# EAGLE design stm_ucboard (EAGLE 6.5.0)
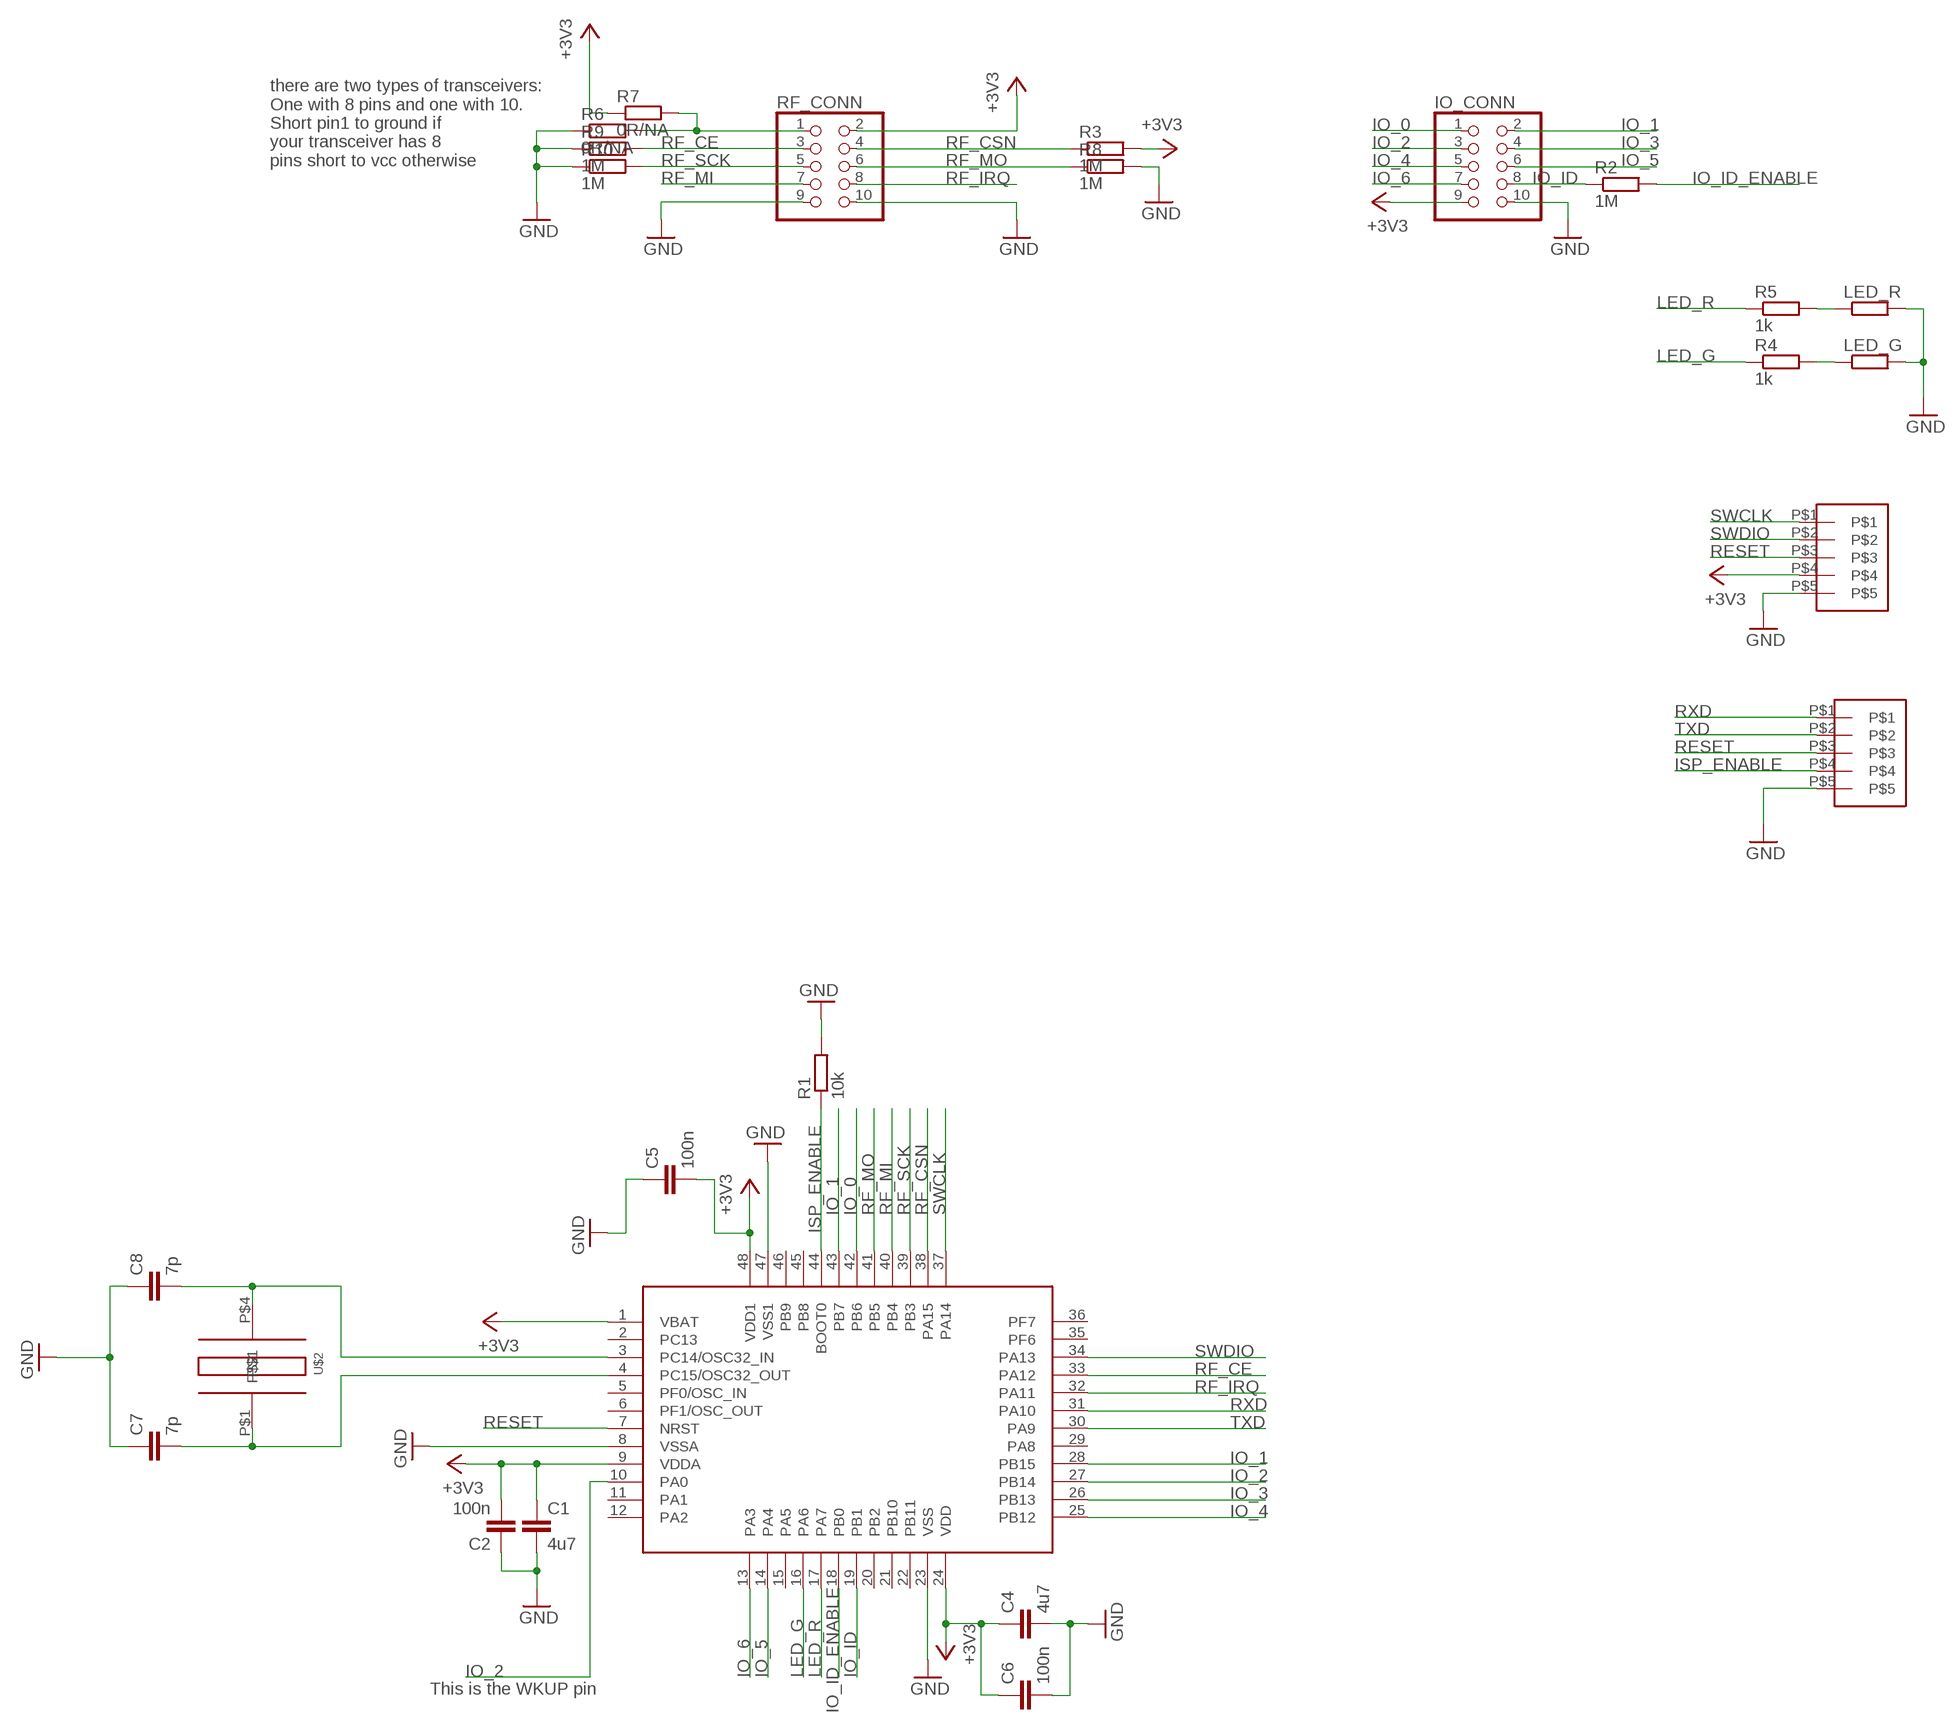
[diagram p0: schematic, sheet 1]

## Parts
C1  4u7  C-EUC0603  [C0603]
C2  100n  C-EUC0603  [C0603]
C4  4u7  C-EUC0603  [C0603]
C5  100n  C-EUC0603  [C0603]
C6  100n  C-EUC0603  [C0603]
C7  7p  C-EUC0603  [C0603]
C8  7p  C-EUC0603  [C0603]
DBG  005CONTACTS  [05HEADER]
IO_CONN  PINHD-2X5  [2X05]
LED_G  R-EU_R0402  [R0402]
LED_R  R-EU_R0402  [R0402]
R1  10k  R-EU_R0402  [R0402]
R2  1M  R-EU_R0402  [R0402]
R3  1M  R-EU_R0402  [R0402]
R4  1k  R-EU_R0402  [R0402]
R5  1k  R-EU_R0402  [R0402]
R6  0R/NA  R-EU_R0201  [R0201]
R7  0R/NA  R-EU_R0201  [R0201]
R8  1M  R-EU_R0402  [R0402]
R9  1M  R-EU_R0402  [R0402]
R10  1M  R-EU_R0402  [R0402]
RF_CONN  PINHD-2X5  [2X05]
U$1  STM32F051  [LQFP48]
U$2  CRYSTAL_32K  [SOJ4]
UART  005CONTACTS  [05HEADER]

## Nets
+3V3: C1.1 C2.2 C4.1 C5.2 C6.1 DBG.P$4 IO_CONN.9 R3.2 R7.1 RF_CONN.2 U$1.1(VBAT) U$1.9(VDDA) U$1.24(VDD) U$1.48(VDD1)
GND: C1.2 C2.1 C4.2 C5.1 C6.2 C7.1 C8.1 DBG.P$5 IO_CONN.10 LED_G.2 LED_R.2 R1.2 R6.1 R8.2 R9.1 R10.1 RF_CONN.9 RF_CONN.10 U$1.8(VSSA) U$1.23(VSS) U$1.47(VSS1) UART.P$5
IO_0: IO_CONN.1 U$1.42(PB6)
IO_1: IO_CONN.2 U$1.28(PB15) U$1.43(PB7)
IO_2: IO_CONN.3 U$1.10(PA0) U$1.27(PB14)
IO_3: IO_CONN.4 U$1.26(PB13)
IO_4: IO_CONN.5 U$1.25(PB12)
IO_5: IO_CONN.6 U$1.14(PA4)
IO_6: IO_CONN.7 U$1.13(PA3)
IO_ID: IO_CONN.8 R2.1 U$1.19(PB1)
IO_ID_ENABLE: R2.2 U$1.18(PB0)
ISP_ENABLE: R1.1 U$1.44(BOOT0) UART.P$4
LED_G: R4.1 U$1.16(PA6)
LED_R: R5.1 U$1.17(PA7)
N$1: LED_R.1 R5.2
N$2: LED_G.1 R4.2
N$3: C8.2 U$1.3(PC14/OSC32_IN) U$2.P$4
N$4: R6.2 R7.2 RF_CONN.1
N$5: C7.2 U$1.4(PC15/OSC32_OUT) U$2.P$1
RESET: DBG.P$3 U$1.7(NRST) UART.P$3
RF_CE: R9.2 RF_CONN.3 U$1.33(PA12)
RF_CSN: R3.1 RF_CONN.4 U$1.38(PA15)
RF_IRQ: RF_CONN.8 U$1.32(PA11)
RF_MI: RF_CONN.7 U$1.40(PB4)
RF_MO: R8.1 RF_CONN.6 U$1.41(PB5)
RF_SCK: R10.2 RF_CONN.5 U$1.39(PB3)
RXD: U$1.31(PA10) UART.P$1
SWCLK: DBG.P$1 U$1.37(PA14)
SWDIO: DBG.P$2 U$1.34(PA13)
TXD: U$1.30(PA9) UART.P$2
Unconnected: U$1.2(PC13) U$1.5(PF0/OSC_IN) U$1.6(PF1/OSC_OUT) U$1.11(PA1) U$1.12(PA2) U$1.15(PA5) U$1.20(PB2) U$1.21(PB10) U$1.22(PB11) U$1.29(PA8) U$1.35(PF6) U$1.36(PF7) U$1.45(PB8) U$1.46(PB9)

## Notes on the sheet
- there are two types of transceivers:
  One with 8 pins and one with 10.
  Short pin1 to ground if 
  your transceiver has 8 
  pins short to vcc otherwise
- This is the WKUP pin

## Library data of the parts
C1 C4 = rcl:C-EU: CAPACITOR, European symbol; DIGIKEY: 1276-2087-1-ND
C2 C5 C6 = rcl:C-EU: CAPACITOR, European symbol; DIGIKEY: 399-1095-1-ND
C7 C8 = rcl:C-EU: CAPACITOR, European symbol; DIGIKEY: 1276-2136-1-ND
DBG UART = viskos:005CONTACTS; DIGIKEY: S9014E-05-ND
IO_CONN = pinhead:PINHD-2X5: PIN HEADER; DIGIKEY: 952-2124-ND
LED_G = rcl:R-EU_: RESISTOR, European symbol; DIGIKEY: 754-1101-1-ND
LED_R = rcl:R-EU_: RESISTOR, European symbol; DIGIKEY: 754-1104-1-ND
R1 = rcl:R-EU_: RESISTOR, European symbol; DIGIKEY: 1276-5086-1-ND
R2 R3 R8-R10 = rcl:R-EU_: RESISTOR, European symbol; DIGIKEY: 1276-4448-1-ND
R4 R5 = rcl:R-EU_: RESISTOR, European symbol; DIGIKEY: 1276-5062-1-ND
R6 R7 = rcl:R-EU_: RESISTOR, European symbol
RF_CONN = pinhead:PINHD-2X5: PIN HEADER; DIGIKEY: S6105-ND
U$1 = stm32f051:STM32F051; DIGIKEY: 497-12893-ND
U$2 = crystal_32k:CRYSTAL_32K; DIGIKEY: 370-1056-1-ND

## Board
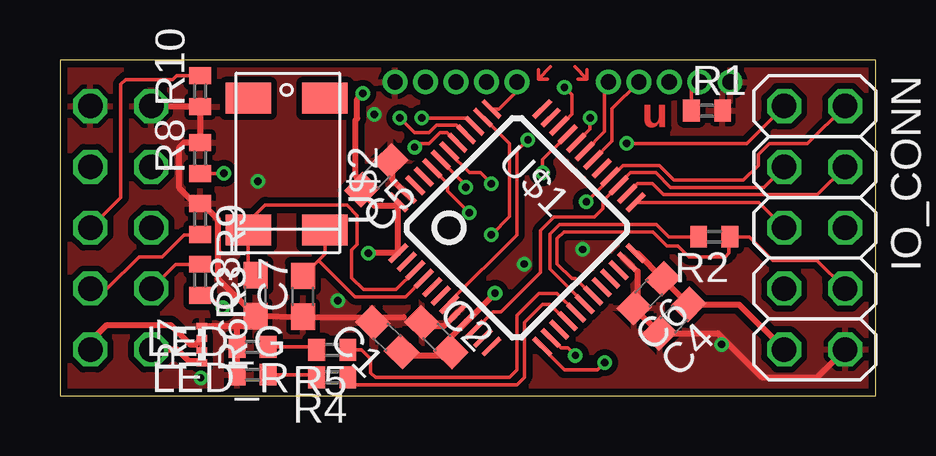
[diagram p1: board, top side]
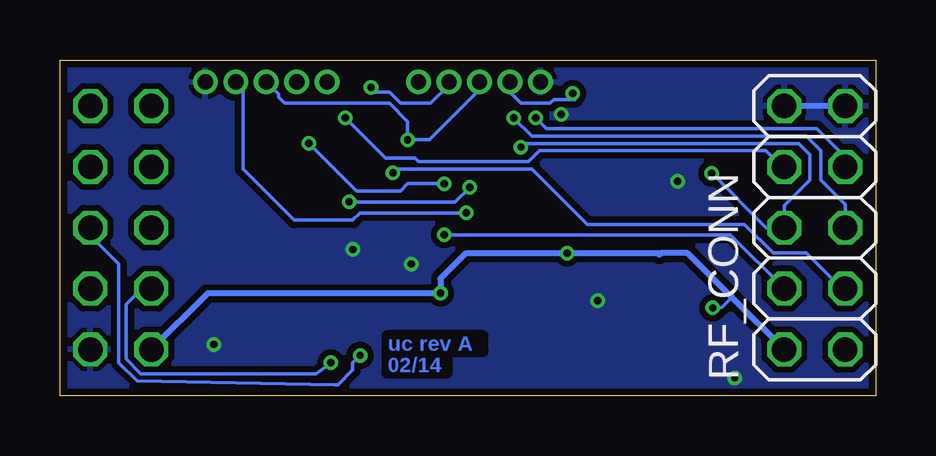
[diagram p2: board, bottom side, seen from below]

Size 34 x 14 mm. Coordinates in mm from the lower left corner, seen from the top.
Outline: 0,0 34,0 34,14 0,14 0,0
Copper layers (1*16): Top 0.035mm / dielectric 1.5mm / Bottom 0.035mm
Design rules "PCB-POOL Standard": minimum track width 0.15mm, minimum drill 0.3mm, track to track 0.15mm, track to pad 0.15mm, pad to pad 0.15mm, via to via 0.15mm, smd to smd 0.15mm, copper to edge 0.3mm, drill to drill 0.2mm, minimum pad ring 0.2mm, minimum via ring 0.15mm, stop-mask expansion 0.075mm, vias tented up to drill 0mil, thermal gap 0.2mm

### Footprints (pad centres in the part's own frame; a part is rotated, then mirrored left to right if it is on the bottom)
C0603 = smd 1.1 x 1: 1 -0.85,0; 2 0.85,0
05HEADER = drill 0.635 pad 0.762: P$1 -2.54,0; P$2 -1.27,0; P$3 0,0; P$4 1.27,0; P$5 2.54,0
2X05 = drill 1.016 octagon: 1 -5.08,-1.27; 2 -5.08,1.27; 3 -2.54,-1.27; 4 -2.54,1.27; 5 0,-1.27; 6 0,1.27; 7 2.54,-1.27; 8 2.54,1.27; 9 5.08,-1.27; 10 5.08,1.27
R0402 = smd 0.7 x 0.9: 1 -0.65,0; 2 0.65,0
R0201 = smd 0.28 x 0.43: 1 -0.255,0; 2 0.255,0
LQFP48 = smd 0.2 x 1: 1 -2.75,-4.25; 2 -2.25,-4.25; 3 -1.75,-4.25; 4 -1.25,-4.25; 5 -0.75,-4.25; 6 -0.25,-4.25; 7 0.25,-4.25; 8 0.75,-4.25; 9 1.25,-4.25; 10 1.75,-4.25; 11 2.25,-4.25; 12 2.75,-4.25; 25 2.75,4.25; 26 2.25,4.25; 27 1.75,4.25; 28 1.25,4.25; 29 0.75,4.25; 30 0.25,4.25; 31 -0.25,4.25; 32 -0.75,4.25; 33 -1.25,4.25; 34 -1.75,4.25; 35 -2.25,4.25; 36 -2.75,4.25 | smd 1 x 0.2: 13 4.25,-2.75; 14 4.25,-2.25; 15 4.25,-1.75; 16 4.25,-1.25; 17 4.25,-0.75; 18 4.25,-0.25; 19 4.25,0.25; 20 4.25,0.75; 21 4.25,1.25; 22 4.25,1.75; 23 4.25,2.25; 24 4.25,2.75; 37 -4.25,2.75; 38 -4.25,2.25; 39 -4.25,1.75; 40 -4.25,1.25; 41 -4.25,0.75; 42 -4.25,0.25; 43 -4.25,-0.25; 44 -4.25,-0.75; 45 -4.25,-1.25; 46 -4.25,-1.75; 47 -4.25,-2.25; 48 -4.25,-2.75
SOJ4 = smd 1.3 x 1.9: P$1 -2.75,-1.6; P$2 2.75,-1.6; P$3 2.75,1.6; P$4 -2.75,1.6

### Placement (x,y rotation side)
C1  13.64,2.44 135 top
C2  15.7,2.44 315 top
C4  25.6,3.2 225 top
C5  13.18,9.19 225 top
C6  24.54,4.27 225 top
C7  10.13,4.14 90 top
C8  8.15,4.17 90 top
DBG  16.51,13.08 180 top
IO_CONN  31.46,7 270 top
LED_G  8.03,0.87 180 top
LED_R  8.03,2.03 180 top
R1  26.97,11.89 0 top
R2  27.28,6.62 180 top
R3  5.84,4.83 270 top
R4  11.35,0.76 180 top
R5  11.35,1.91 180 top
R6  5.92,2.64 270 top
R7  5.92,1.62 90 top
R8  5.84,9.91 90 top
R9  5.84,7.37 270 top
R10  5.84,12.7 90 top
RF_CONN  2.54,7 90 bottom
U$1  19.05,7 315 top
U$2  9.45,9.65 90 top
UART  25.4,13.08 0 top

### Tracks (layer width: path | path; a pad name or v marks a point on that pad's centre or on a via)
+3V3  (via drill 0.3)
  Top 0.152: U$1.24 24.07,5.94 | 12.81,5.94 v12.85,5.94 | U$1.9 16.98,3.11 | R3.2 6.16,4.18 v6.78,3.66
  Top 0.254: 24.07,5.94 C6.1 C4.1 28.31,3.8 IO_CONN.9 | RF_CONN.2 4.89,1.92 5.36,1.45 5.9,1.45 R7.1 | 12.81,5.94 U$1.1 U$1.48 13.96,7.92 13.11,7.92 12.64,8.39 C5.2 12.32,9.19 12.32,11.48 12.39,11.56 12.39,12.37 v12.62,12.6 | 16.98,3.11 v18.14,4.27 | U$1.9 16.93,3.06 16.31,2.44 C2.2 16.14,1.68 14.78,1.68 14.62,1.84 C1.1
  Bottom 0.152: v12.62,12.6 12.52,12.34 13.41,12.34 13.56,12.19 14.78,12.19 15.24,12.65 DBG.P$4 | v6.78,3.66 6.4,3.68 5.99,4.1
  Bottom 0.254: 8.94,5.94 v12.85,5.94 17.07,5.94 18.14,4.88 v18.14,4.27 27.84,4.27 IO_CONN.9 | RF_CONN.2 5.99,4.1 7.83,5.94 8.94,5.94 | 8.94,5.94 9.02,5.87
GND  (via drill 0.3)
  Top 0.152: U$1.23 23.68,5.59 | 24.08,3.81 C6.2 | U$1.47 | 13.87,9.89 C5.1
  Top 0.254: 23.68,5.59 24.08,5.18 24.08,3.81 | C6.2 C4.2 27.42,2.6 29.26,0.76 31.57,0.76 IO_CONN.10 | U$1.47 13.87,8.99 13.87,9.89 | LED_G.2 LED_R.2 7.38,2.85 7.34,2.9 | C8.1 C7.1 14.34,3.27 | U$1.8 16,2.9 15.24,2.9 C2.1 | C8.1 6.58,4.89 6.58,7.37 6.31,7.63 R9.1 5.62,8.02 4.98,8.66 4.98,10.34 5.21,10.57 R8.2 R10.1 5.81,12.08 RF_CONN.10 | R6.1 7.34,2.9 | 7.34,2.9 7.73,2.9 C8.1
  Bottom 0.254: RF_CONN.9 RF_CONN.10
  other vias: 13.11,11.73 27.58,2.13 11.58,3.96 5.87,0.74 8.26,8.94 21.79,6.1 19.35,5.49
  pour Top (isolate 0.254): 0,14.17 34.29,14.17 34.29,0 0,0
  pour Bottom (isolate 0.254): 0,14.63 34.75,14.63 34.75,-0.3 0,-0.3
IO_0  (via drill 0.3)
  Top 0.152: U$1.42 16.22,10.14 17.07,9.3 17.53,9.3 v17.98,8.84 | v23.62,10.52 28.63,10.52 IO_CONN.1
  Bottom 0.152: v17.98,8.84 19.51,8.84 19.81,8.53 21.64,8.53 v23.62,10.52
IO_1  (via drill 0.3)
  Top 0.152: IO_CONN.2 31.17,10.52 29.57,10.52 29.11,10.06 29.11,9.6 28.5,8.99 25.6,8.99 24.99,9.6 23.47,9.6 22.99,9.12 U$1.28 22.94,9.07 v21.95,8.08 | v16.92,8.69 16.92,8.78 U$1.43
  Bottom 0.152: v21.95,8.08 17.53,8.08 v16.92,8.69
IO_2
  Top 0.152: IO_CONN.3 29.34,8.69 25.45,8.69 24.84,9.3 23.77,9.3 23.29,8.81 U$1.27 22.63,8.11 22.63,7.8 22.28,7.44 20.6,7.44 20.04,6.88 20.04,5.13 18.39,3.48 18.06,3.48 17.34,2.76 U$1.10
IO_3
  Top 0.152: U$1.26 24.08,8.84 24.69,8.84 25.15,8.38 31.57,8.38 IO_CONN.4
IO_4
  Top 0.152: U$1.25 29.13,8.06 IO_CONN.5
IO_5  (via drill 0.3)
  Top 0.152: U$1.14 20.88,1.98 21.18,1.98 v21.49,1.68
  Bottom 0.152: IO_CONN.6 32.73,6.67 31.55,5.49 31.55,1.37 30.79,0.61 22.55,0.46 22.4,0.46 21.79,1.07 21.79,1.37 v21.49,1.68
IO_6  (via drill 0.3)
  Top 0.152: U$1.13 20.11,1.99 21.03,1.07 22.4,1.07 v22.71,1.37
  Bottom 0.152: IO_CONN.7 30.59,4.46 31.24,3.81 31.24,1.52 30.63,0.91 23.32,0.91 v22.71,1.37
IO_ID
  Top 0.152: U$1.19 22.19,4.17 21.49,4.88 21.34,4.88 20.73,5.49 20.73,6.55 21.01,6.83 24.71,6.83 25.3,6.25 25.76,6.25 26.21,5.79 27.74,5.79 27.89,5.94 27.89,6.59 R2.1 28.73,6.62 29.72,5.64 31.55,5.64 IO_CONN.8
IO_ID_ENABLE
  Top 0.152: R2.2 25.38,6.62 24.87,7.14 20.83,7.14 20.42,6.73 20.42,5.28 U$1.18
ISP_ENABLE  (via drill 0.3)
  Top 0.152: U$1.44 16.15,8.84 16.15,8.53 v17.07,7.62 | R1.1 26.32,12.74 UART.P$4
  Bottom 0.152: v17.07,7.62 21.49,7.62 21.79,7.32 24.23,7.32 26.36,9.45 26.36,12.78 UART.P$4
LED_G
  Top 0.152: U$1.16 21.12,3.11 20.42,3.81 20.12,3.81 19.36,3.05 19.36,0.76 19.05,0.46 12.31,0.46 R4.1
LED_R
  Top 0.152: U$1.17 20.73,4.27 19.96,4.27 19.05,3.35 19.05,1.07 18.75,0.76 13.15,0.76 12.95,0.95 12.95,1.52 12.57,1.91 R5.1
N$1
  Top 0.152: LED_R.1 10.68,2.03 R5.2
N$2
  Top 0.152: LED_G.1 10.66,0.87 R4.2
N$3
  Top 0.152: U$1.3 14.81,5.21 14.02,4.42 12.65,4.42 12.17,4.9 12.17,6.07 12.39,6.3 12.39,7.52 11.96,7.95 8.56,7.95 7.37,6.76 U$2.P$4 7.85,5.32 C8.2
N$4
  Top 0.254: 1.27,2.03 RF_CONN.1 1.27,2.26 1.96,2.95 4.62,2.95 5.44,2.13 5.67,2.13 R6.2 R7.2
N$5
  Top 0.152: U$1.4 14.4,4.12 12.29,4.12 10.78,5.63 | U$2.P$1 11.05,5.9 10.78,5.63 | 10.78,5.63 C7.2
N$6
  Top 0.152: 19.94,13.21 20.45,13.72 | 19.94,13.21 19.94,13.59 | 19.94,13.21 20.32,13.21
N$7
  Top 0.152: 21.97,13.21 21.46,13.72 | 21.97,13.21 21.97,13.59 | 21.97,13.21 21.59,13.21
RESET  (via drill 0.3)
  Top 0.152: U$1.7 16.22,3.88 19.05,6.71 19.05,10.21 v19.51,10.67
  Bottom 0.152: UART.P$3 24.89,12.57 24.89,12.45 24.64,12.19 20.27,12.19 19.51,11.43 v19.51,10.67 18.59,10.67 16.51,12.75 DBG.P$3
RF_CE  (via drill 0.3)
  Top 0.152: v20.12,9.3 20.12,9.84 U$1.33 | RF_CONN.3 1.97,4.46 3.3,5.79 4.27,5.79 5.18,6.71 5.83,6.71 R9.2
  Bottom 0.152: RF_CONN.3 1.41,4.46 2.9,5.94 4.27,5.94 5.46,7.14 12.01,7.14 14.33,9.45 19.96,9.45 v20.12,9.3
RF_CSN  (via drill 0.3)
  Top 0.152: U$1.38 17.66,11.6 18.75,10.52 18.75,7.47 v17.98,6.71 | R3.1 4.83,5.48 RF_CONN.4
  Bottom 0.152: v17.98,6.71 6.06,6.71 RF_CONN.4
RF_IRQ  (via drill 0.3)
  Top 0.152: v22.1,11.58 22.1,11.11 U$1.32
  Bottom 0.152: RF_CONN.8 3.9,9.54 4.57,10.21 14.02,10.21 14.48,9.75 19.05,9.75 19.2,9.91 20.42,9.91 v22.1,11.58
RF_MI  (via drill 0.3)
  Top 0.152: v14.17,11.58 14.78,10.97 15.39,10.97 15.7,11.28 16.54,11.28 U$1.40
  Bottom 0.152: RF_CONN.7 1.27,9.96 2.44,11.12 13.72,11.12 v14.17,11.58
RF_MO  (via drill 0.3)
  Top 0.152: U$1.41 16.14,10.97 15.85,10.97 15.39,10.52 14.94,10.52 v14.78,10.36 | R8.1 6.82,9.26 v6.83,9.27
  Bottom 0.152: v14.78,10.36 14.63,10.52 3.2,10.52 2.74,10.06 2.74,8.99 3.81,7.92 RF_CONN.6 4.56,7 v6.83,9.27
RF_SCK  (via drill 0.3)
  Top 0.152: v15.09,11.58 16.94,11.58 U$1.39 | RF_CONN.5 2.54,8.27 2.54,12.98 2.74,13.18 4.7,13.18 4.87,13.35 R10.2
  Bottom 0.152: RF_CONN.5 1.27,7.98 2.29,8.99 2.29,10.21 2.9,10.82 14.33,10.82 v15.09,11.58
RXD
  Top 0.152: U$1.31 22.71,11.01 22.71,12.93 UART.P$1
SWCLK
  Top 0.152: U$1.37 18.3,11.95 18.92,12.57 18.92,12.95 DBG.P$1
SWDIO  (via drill 0.3)
  Top 0.152: U$1.34 20.84,11.24 21.34,11.73 21.34,12.55 v21.03,12.85
  Bottom 0.152: DBG.P$2 17.78,12.95 18.54,12.19 19.81,12.19 20.27,12.65 20.95,12.65 v21.03,12.85
TXD
  Top 0.152: U$1.30 23.01,10.61 23.01,11.96 UART.P$2

### Text on the board
Top: u
Bottom: uc rev A | 02/14
tDocu: RF | FEMALE / BOTTOM | IO | MALE / TOP